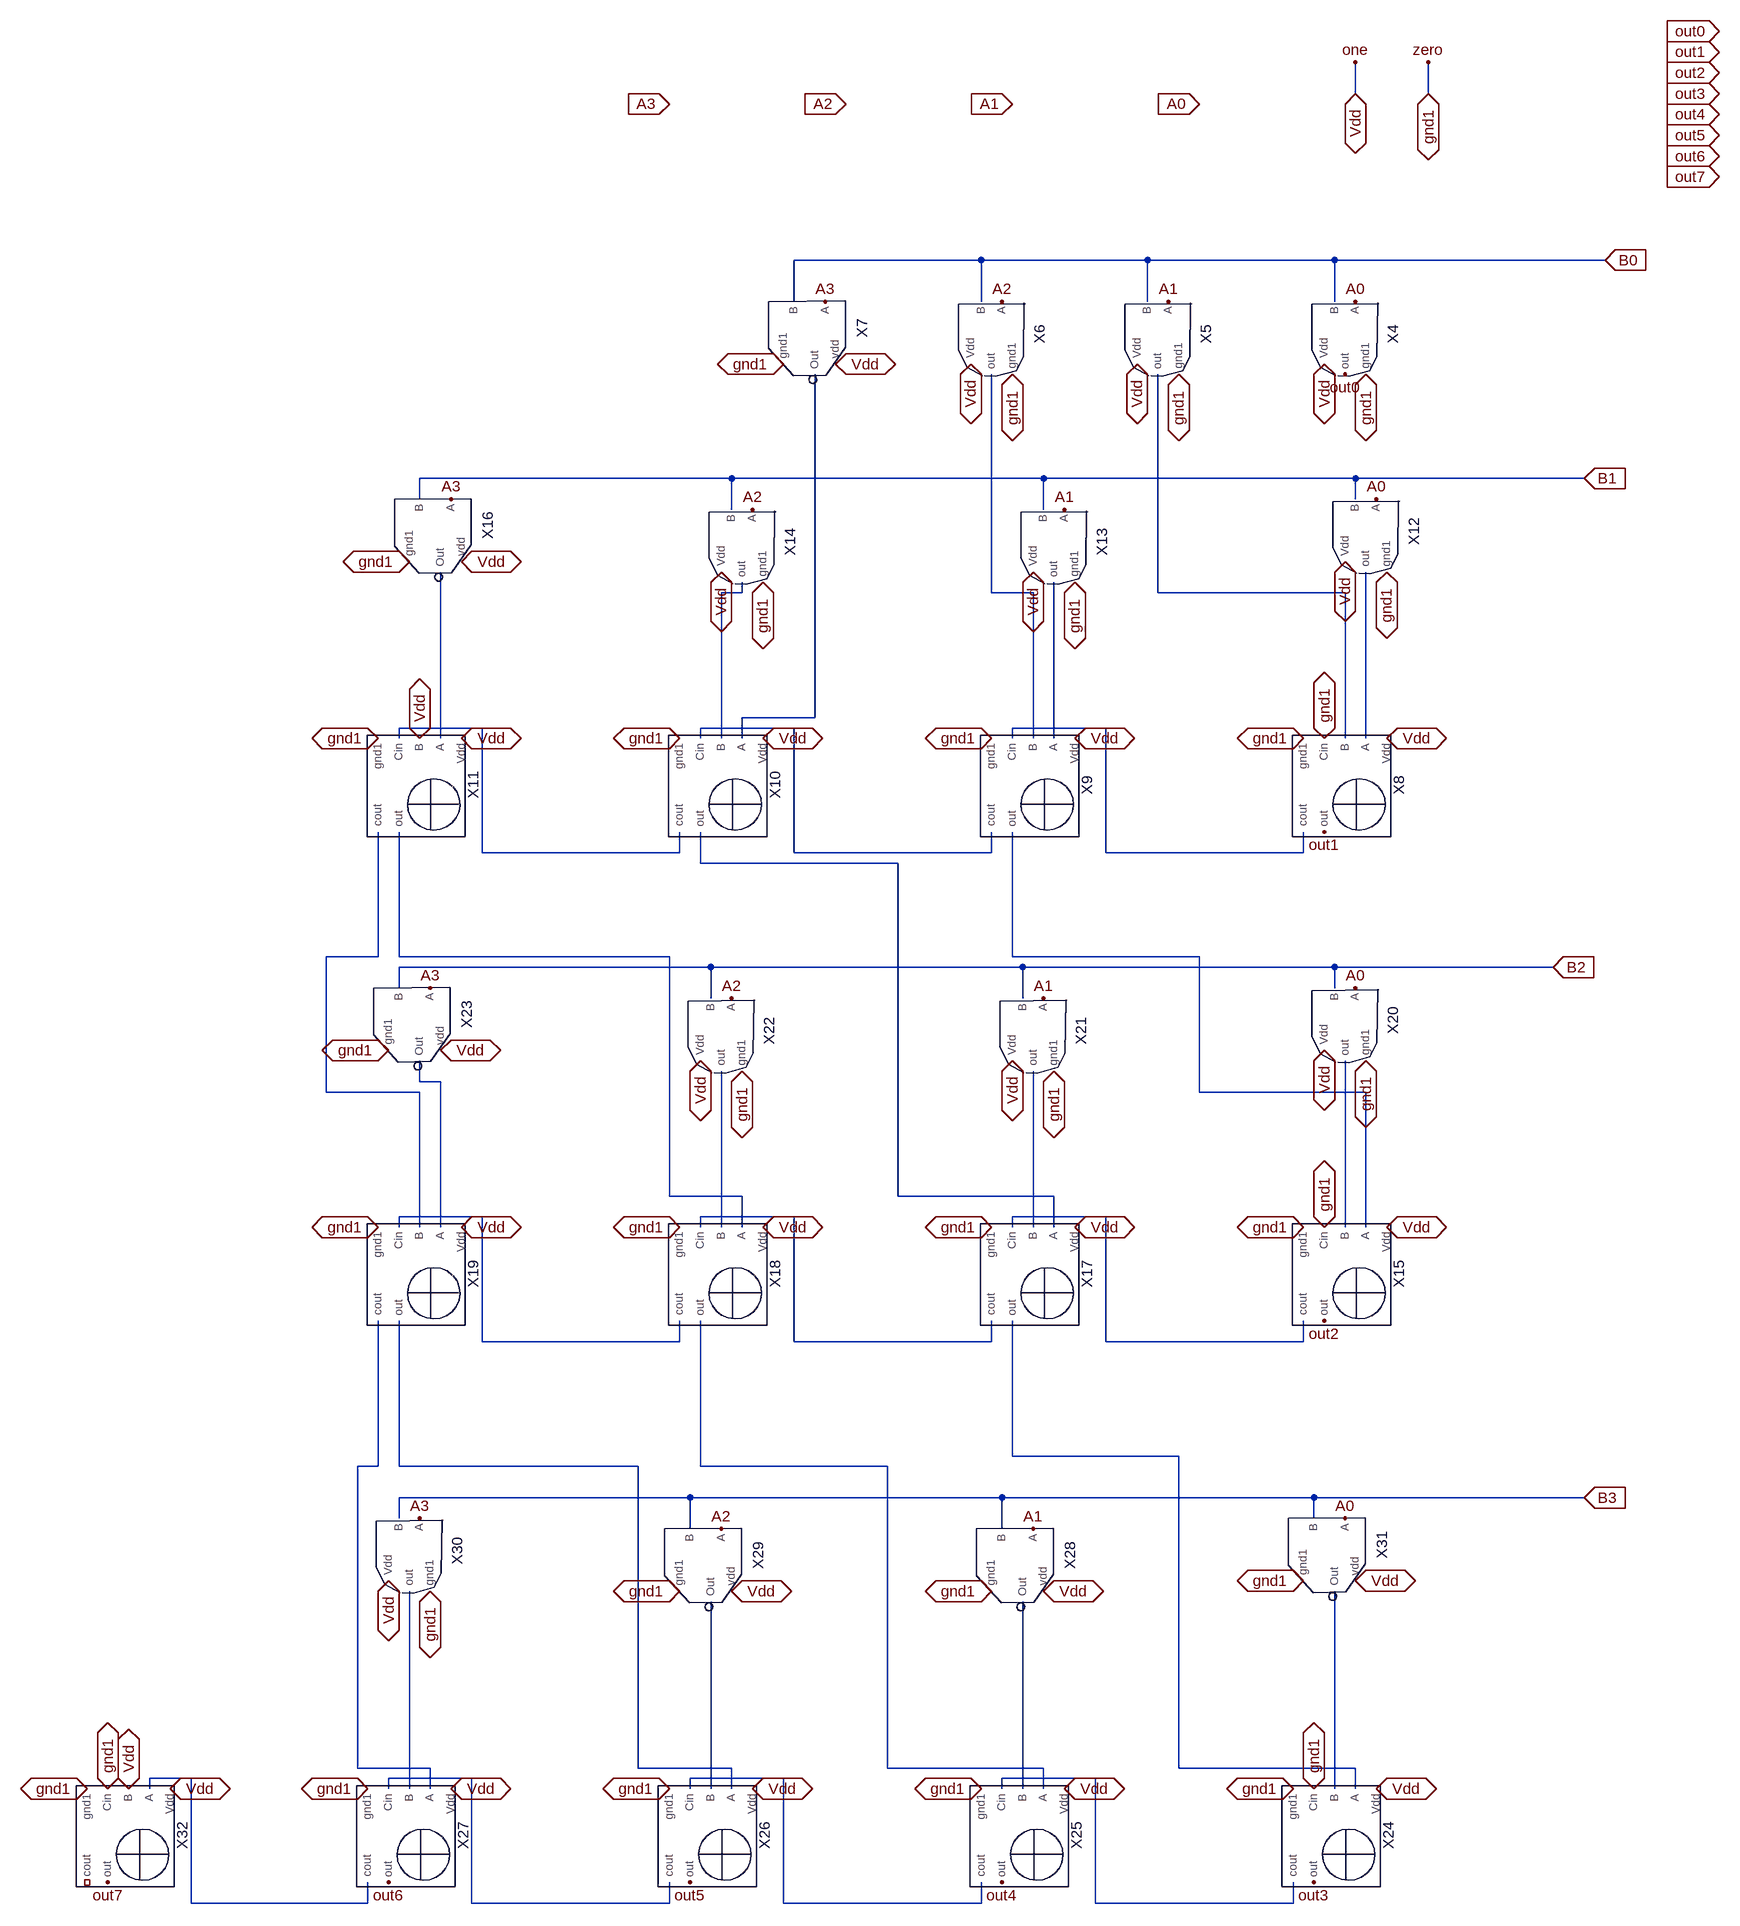
[diagram p0: schematic mult1.asc]
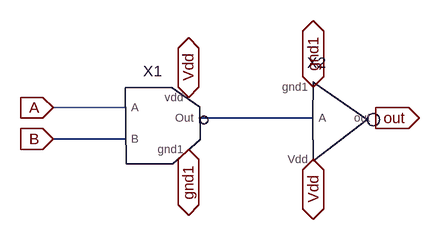
[diagram p1: sub-circuit anddddd.asc]
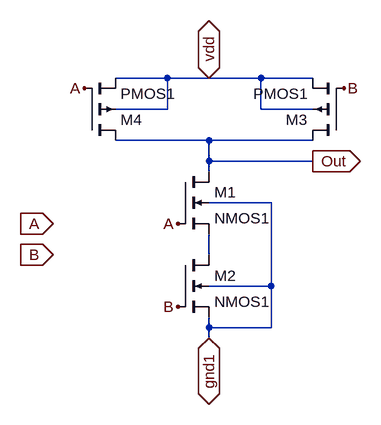
[diagram p2: sub-circuit nand.asc]
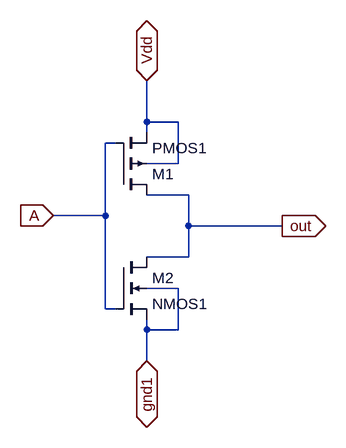
[diagram p3: sub-circuit not.asc]
mult1.asc, the LTspice schematic file:
Version 4.1
SHEET 1 1212 2548
WIRE 224 -304 224 -352
WIRE 336 -304 336 -352
WIRE -352 -48 -640 -48
WIRE -96 -48 -352 -48
WIRE 192 -48 -96 -48
WIRE 608 -48 192 -48
WIRE -640 16 -640 -48
WIRE -352 16 -352 -48
WIRE -96 16 -96 -48
WIRE 192 16 192 -48
WIRE -736 288 -1216 288
WIRE -256 288 -736 288
WIRE 224 288 -256 288
WIRE 576 288 224 288
WIRE -1216 320 -1216 288
WIRE 224 320 224 288
WIRE -736 336 -736 288
WIRE -256 336 -256 288
WIRE -720 464 -720 448
WIRE -720 464 -752 464
WIRE -336 464 -336 128
WIRE -272 464 -336 464
WIRE -80 464 -80 128
WIRE 208 464 -80 464
WIRE -608 656 -608 128
WIRE -608 656 -720 656
WIRE -1120 672 -1248 672
WIRE -640 672 -784 672
WIRE -160 672 -304 672
WIRE -1248 688 -1248 672
WIRE -1184 688 -1184 432
WIRE -784 688 -784 672
WIRE -752 688 -752 464
WIRE -720 688 -720 656
WIRE -304 688 -304 672
WIRE -272 688 -272 464
WIRE -240 688 -240 448
WIRE 208 688 208 464
WIRE 240 688 240 432
WIRE -1120 864 -1120 672
WIRE -816 864 -816 832
WIRE -816 864 -1120 864
WIRE -640 864 -640 672
WIRE -336 864 -336 832
WIRE -336 864 -640 864
WIRE -160 864 -160 672
WIRE 144 864 144 832
WIRE 144 864 -160 864
WIRE -784 880 -784 832
WIRE -480 880 -784 880
WIRE -1280 1024 -1280 832
WIRE -1280 1024 -1360 1024
WIRE -1248 1024 -1248 832
WIRE -832 1024 -1248 1024
WIRE -304 1024 -304 832
WIRE -16 1024 -304 1024
WIRE -768 1040 -1248 1040
WIRE -288 1040 -768 1040
WIRE 192 1040 -288 1040
WIRE 528 1040 192 1040
WIRE -1248 1072 -1248 1040
WIRE 192 1072 192 1040
WIRE -768 1088 -768 1040
WIRE -288 1088 -288 1040
WIRE -1216 1216 -1216 1184
WIRE -1184 1216 -1216 1216
WIRE -1360 1232 -1360 1024
WIRE -1216 1232 -1360 1232
WIRE -16 1232 -16 1024
WIRE 240 1232 -16 1232
WIRE -832 1392 -832 1024
WIRE -720 1392 -832 1392
WIRE -480 1392 -480 880
WIRE -240 1392 -480 1392
WIRE -1120 1424 -1248 1424
WIRE -640 1424 -784 1424
WIRE -160 1424 -304 1424
WIRE -1248 1440 -1248 1424
WIRE -1216 1440 -1216 1232
WIRE -1184 1440 -1184 1216
WIRE -784 1440 -784 1424
WIRE -752 1440 -752 1200
WIRE -720 1440 -720 1392
WIRE -304 1440 -304 1424
WIRE -272 1440 -272 1200
WIRE -240 1440 -240 1392
WIRE 208 1440 208 1184
WIRE 240 1440 240 1232
WIRE -1120 1616 -1120 1424
WIRE -816 1616 -816 1584
WIRE -816 1616 -1120 1616
WIRE -640 1616 -640 1424
WIRE -336 1616 -336 1584
WIRE -336 1616 -640 1616
WIRE -160 1616 -160 1424
WIRE 144 1616 144 1584
WIRE 144 1616 -160 1616
WIRE -304 1792 -304 1584
WIRE -48 1792 -304 1792
WIRE -1280 1808 -1280 1584
WIRE -1280 1808 -1312 1808
WIRE -1248 1808 -1248 1584
WIRE -880 1808 -1248 1808
WIRE -784 1808 -784 1584
WIRE -496 1808 -784 1808
WIRE -800 1856 -1248 1856
WIRE -320 1856 -800 1856
WIRE 160 1856 -320 1856
WIRE 576 1856 160 1856
WIRE -1248 1888 -1248 1856
WIRE 160 1888 160 1856
WIRE -800 1904 -800 1856
WIRE -320 1904 -320 1856
WIRE -1312 2272 -1312 1808
WIRE -1200 2272 -1312 2272
WIRE -880 2272 -880 1808
WIRE -736 2272 -880 2272
WIRE -496 2272 -496 1808
WIRE -256 2272 -496 2272
WIRE -48 2272 -48 1792
WIRE 224 2272 -48 2272
WIRE -1568 2288 -1632 2288
WIRE -1136 2288 -1264 2288
WIRE -656 2288 -800 2288
WIRE -176 2288 -320 2288
WIRE -1632 2304 -1632 2288
WIRE -1264 2304 -1264 2288
WIRE -1232 2304 -1232 2000
WIRE -1200 2304 -1200 2272
WIRE -800 2304 -800 2288
WIRE -768 2304 -768 2016
WIRE -736 2304 -736 2272
WIRE -320 2304 -320 2288
WIRE -288 2304 -288 2016
WIRE -256 2304 -256 2272
WIRE 192 2304 192 2000
WIRE 224 2304 224 2272
WIRE -1568 2480 -1568 2288
WIRE -1296 2480 -1296 2448
WIRE -1296 2480 -1568 2480
WIRE -1136 2480 -1136 2288
WIRE -832 2480 -832 2448
WIRE -832 2480 -1136 2480
WIRE -656 2480 -656 2288
WIRE -352 2480 -352 2448
WIRE -352 2480 -656 2480
WIRE -176 2480 -176 2288
WIRE 128 2480 128 2448
WIRE 128 2480 -176 2480
FLAG -16 -288 A0
IOPIN -16 -288 In
FLAG -304 -288 A1
IOPIN -304 -288 In
FLAG -560 -288 A2
IOPIN -560 -288 In
FLAG -832 -288 A3
IOPIN -832 -288 In
FLAG 608 -48 B0
IOPIN 608 -48 In
FLAG 576 288 B1
IOPIN 576 288 In
FLAG 528 1040 B2
IOPIN 528 1040 In
FLAG 576 1856 B3
IOPIN 576 1856 In
FLAG 704 -400 out0
IOPIN 704 -400 Out
FLAG 704 -368 out1
IOPIN 704 -368 Out
FLAG 704 -336 out2
IOPIN 704 -336 Out
FLAG 704 -304 out3
IOPIN 704 -304 Out
FLAG 704 -272 out4
IOPIN 704 -272 Out
FLAG 704 -240 out5
IOPIN 704 -240 Out
FLAG 704 -208 out6
IOPIN 704 -208 Out
FLAG 704 -176 out7
IOPIN 704 -176 Out
FLAG 208 128 out0
FLAG -224 336 A1
FLAG -704 336 A2
FLAG -1168 320 A3
FLAG 336 -352 zero
FLAG 224 -352 one
FLAG 256 320 A0
FLAG 176 832 out1
FLAG 176 1584 out2
FLAG -256 1088 A1
FLAG -736 1088 A2
FLAG -1200 1072 A3
FLAG 224 1072 A0
FLAG 160 2448 out3
FLAG -272 1904 A1
FLAG -752 1904 A2
FLAG -1216 1888 A3
FLAG 208 1888 A0
FLAG -320 2448 out4
FLAG -800 2448 out5
FLAG -1264 2448 out6
FLAG -1696 2448 out7
FLAG 336 -304 gnd1
IOPIN 336 -304 BiDir
FLAG 224 -304 Vdd
IOPIN 224 -304 BiDir
FLAG -688 448 gnd1
IOPIN -688 448 BiDir
FLAG 240 128 gnd1
IOPIN 240 128 BiDir
FLAG -48 128 gnd1
IOPIN -48 128 BiDir
FLAG -304 128 gnd1
IOPIN -304 128 BiDir
FLAG -656 112 gnd1
IOPIN -656 112 BiDir
FLAG -208 448 gnd1
IOPIN -208 448 BiDir
FLAG 272 432 gnd1
IOPIN 272 432 BiDir
FLAG -1280 688 gnd1
IOPIN -1280 688 BiDir
FLAG 240 1184 gnd1
IOPIN 240 1184 BiDir
FLAG -240 1200 gnd1
IOPIN -240 1200 BiDir
FLAG -720 1200 gnd1
IOPIN -720 1200 BiDir
FLAG -1264 1168 gnd1
IOPIN -1264 1168 BiDir
FLAG -816 688 gnd1
IOPIN -816 688 BiDir
FLAG -336 688 gnd1
IOPIN -336 688 BiDir
FLAG 144 688 gnd1
IOPIN 144 688 BiDir
FLAG 144 1440 gnd1
IOPIN 144 1440 BiDir
FLAG -336 1440 gnd1
IOPIN -336 1440 BiDir
FLAG -816 1440 gnd1
IOPIN -816 1440 BiDir
FLAG -1280 1440 gnd1
IOPIN -1280 1440 BiDir
FLAG 144 1984 gnd1
IOPIN 144 1984 BiDir
FLAG 128 2304 gnd1
IOPIN 128 2304 BiDir
FLAG -352 2304 gnd1
IOPIN -352 2304 BiDir
FLAG -336 2000 gnd1
IOPIN -336 2000 BiDir
FLAG -816 2000 gnd1
IOPIN -816 2000 BiDir
FLAG -832 2304 gnd1
IOPIN -832 2304 BiDir
FLAG -1200 2000 gnd1
IOPIN -1200 2000 BiDir
FLAG -1296 2304 gnd1
IOPIN -1296 2304 BiDir
FLAG -1728 2304 gnd1
IOPIN -1728 2304 BiDir
FLAG 176 112 Vdd
IOPIN 176 112 BiDir
FLAG -112 112 Vdd
IOPIN -112 112 BiDir
FLAG -368 112 Vdd
IOPIN -368 112 BiDir
FLAG -576 112 Vdd
IOPIN -576 112 BiDir
FLAG -752 432 Vdd
IOPIN -752 432 BiDir
FLAG -272 432 Vdd
IOPIN -272 432 BiDir
FLAG 208 416 Vdd
IOPIN 208 416 BiDir
FLAG 272 688 Vdd
IOPIN 272 688 BiDir
FLAG -208 688 Vdd
IOPIN -208 688 BiDir
FLAG -688 688 Vdd
IOPIN -688 688 BiDir
FLAG -1152 688 Vdd
IOPIN -1152 688 BiDir
FLAG -1184 1168 Vdd
IOPIN -1184 1168 BiDir
FLAG -784 1184 Vdd
IOPIN -784 1184 BiDir
FLAG -304 1184 Vdd
IOPIN -304 1184 BiDir
FLAG 176 1168 Vdd
IOPIN 176 1168 BiDir
FLAG 272 1440 Vdd
IOPIN 272 1440 BiDir
FLAG -208 1440 Vdd
IOPIN -208 1440 BiDir
FLAG -688 1440 Vdd
IOPIN -688 1440 BiDir
FLAG -1152 1440 Vdd
IOPIN -1152 1440 BiDir
FLAG -1264 1984 Vdd
IOPIN -1264 1984 BiDir
FLAG -736 2000 Vdd
IOPIN -736 2000 BiDir
FLAG -256 2000 Vdd
IOPIN -256 2000 BiDir
FLAG 224 1984 Vdd
IOPIN 224 1984 BiDir
FLAG 256 2304 Vdd
IOPIN 256 2304 BiDir
FLAG -224 2304 Vdd
IOPIN -224 2304 BiDir
FLAG -704 2304 Vdd
IOPIN -704 2304 BiDir
FLAG -1168 2304 Vdd
IOPIN -1168 2304 BiDir
FLAG -1600 2304 Vdd
IOPIN -1600 2304 BiDir
FLAG 224 16 A0
FLAG -64 16 A1
FLAG -320 16 A2
FLAG -592 16 A3
FLAG 176 688 gnd1
IOPIN 176 688 BiDir
FLAG 176 1440 gnd1
IOPIN 176 1440 BiDir
FLAG 160 2304 gnd1
IOPIN 160 2304 BiDir
FLAG -1696 2304 gnd1
IOPIN -1696 2304 BiDir
FLAG -1664 2304 Vdd
IOPIN -1664 2304 BiDir
FLAG -1216 688 Vdd
IOPIN -1216 688 BiDir
FLAG -1152 416 Vdd
IOPIN -1152 416 BiDir
FLAG -1232 416 gnd1
IOPIN -1232 416 BiDir
SYMBOL ANDDDDD 208 64 R90
SYMATTR InstName X4
SYMBOL ANDDDDD -80 64 R90
SYMATTR InstName X5
SYMBOL ANDDDDD -336 64 R90
SYMATTR InstName X6
SYMBOL NAND -624 64 R90
SYMATTR InstName X7
SYMBOL full_adder 208 752 R90
SYMATTR InstName X8
SYMBOL full_adder -272 752 R90
SYMATTR InstName X9
SYMBOL full_adder -752 752 R90
SYMATTR InstName X10
SYMBOL full_adder -1216 752 R90
SYMATTR InstName X11
SYMBOL ANDDDDD 240 368 R90
SYMATTR InstName X12
SYMBOL ANDDDDD -240 384 R90
SYMATTR InstName X13
SYMBOL ANDDDDD -720 384 R90
SYMATTR InstName X14
SYMBOL NAND -1200 368 R90
SYMATTR InstName X16
SYMBOL full_adder 208 1504 R90
SYMATTR InstName X15
SYMBOL full_adder -272 1504 R90
SYMATTR InstName X17
SYMBOL full_adder -752 1504 R90
SYMATTR InstName X18
SYMBOL full_adder -1216 1504 R90
SYMATTR InstName X19
SYMBOL ANDDDDD 208 1120 R90
SYMATTR InstName X20
SYMBOL ANDDDDD -272 1136 R90
SYMATTR InstName X21
SYMBOL ANDDDDD -752 1136 R90
SYMATTR InstName X22
SYMBOL NAND -1232 1120 R90
SYMATTR InstName X23
SYMBOL full_adder 192 2368 R90
SYMATTR InstName X24
SYMBOL full_adder -288 2368 R90
SYMATTR InstName X25
SYMBOL full_adder -768 2368 R90
SYMATTR InstName X26
SYMBOL full_adder -1232 2368 R90
SYMATTR InstName X27
SYMBOL ANDDDDD -1232 1936 R90
SYMATTR InstName X30
SYMBOL NAND 176 1936 R90
SYMATTR InstName X31
SYMBOL NAND -304 1952 R90
SYMATTR InstName X28
SYMBOL NAND -784 1952 R90
SYMATTR InstName X29
SYMBOL full_adder -1664 2368 R90
SYMATTR InstName X32

anddddd.asc, the sub-circuit schematic file:
Version 4.1
SHEET 1 880 680
WIRE 64 160 -48 160
WIRE 352 176 176 176
WIRE 64 208 -48 208
FLAG -48 160 A
IOPIN -48 160 In
FLAG -48 208 B
IOPIN -48 208 In
FLAG 160 224 gnd1
IOPIN 160 224 BiDir
FLAG 160 144 Vdd
IOPIN 160 144 BiDir
FLAG 352 128 gnd1
IOPIN 352 128 BiDir
FLAG 352 240 Vdd
IOPIN 352 240 BiDir
FLAG 448 176 out
IOPIN 448 176 Out
SYMBOL NAND 112 192 R0
SYMATTR InstName X1
SYMBOL NOT 384 176 R0
SYMATTR InstName X2

nand.asc, the sub-circuit schematic file:
Version 4.1
SHEET 1 880 680
WIRE 176 0 96 0
WIRE 240 0 176 0
WIRE 320 0 240 0
WIRE 400 0 320 0
WIRE 176 48 176 0
WIRE 176 48 96 48
WIRE 320 48 320 0
WIRE 400 48 320 48
WIRE 240 96 96 96
WIRE 400 96 240 96
WIRE 240 128 240 96
WIRE 400 128 240 128
WIRE 240 144 240 128
WIRE 336 192 240 192
WIRE 240 272 240 240
WIRE 336 320 336 192
WIRE 336 320 240 320
WIRE 240 384 240 368
WIRE 336 384 336 320
WIRE 336 384 240 384
WIRE 240 400 240 384
FLAG 0 224 A
IOPIN 0 224 In
FLAG 0 272 B
IOPIN 0 272 In
FLAG 400 128 Out
IOPIN 400 128 Out
FLAG 240 400 gnd1
IOPIN 240 400 BiDir
FLAG 240 0 vdd
IOPIN 240 0 BiDir
FLAG 48 16 A
FLAG 192 224 A
FLAG 192 352 B
FLAG 448 16 B
SYMBOL nmos4 192 144 R0
SYMATTR InstName M1
SYMATTR Value2 l=1u w=2u
SYMATTR Value NMOS1
SYMBOL nmos4 192 272 R0
SYMATTR InstName M2
SYMATTR Value2 l=1u w=2u
SYMATTR Value NMOS1
SYMBOL pmos4 448 96 R180
SYMATTR InstName M3
SYMATTR Value2 l=1u w=2u
SYMATTR Value PMOS1
SYMBOL pmos4 48 96 M180
SYMATTR InstName M4
SYMATTR Value2 l=1u w=2u
SYMATTR Value PMOS1

not.asc, the sub-circuit schematic file:
Version 4.1
SHEET 1 880 680
WIRE 256 64 256 0
WIRE 304 64 256 64
WIRE 256 80 256 64
WIRE 208 96 192 96
WIRE 304 128 304 64
WIRE 304 128 256 128
WIRE 320 176 256 176
WIRE 192 208 192 96
WIRE 192 208 112 208
WIRE 320 224 320 176
WIRE 464 224 320 224
WIRE 320 272 320 224
WIRE 320 272 256 272
WIRE 304 320 256 320
WIRE 192 352 192 208
WIRE 208 352 192 352
WIRE 256 384 256 368
WIRE 304 384 304 320
WIRE 304 384 256 384
WIRE 256 432 256 384
FLAG 256 432 gnd1
IOPIN 256 432 BiDir
FLAG 256 0 Vdd
IOPIN 256 0 BiDir
FLAG 464 224 out
IOPIN 464 224 Out
FLAG 112 208 A
IOPIN 112 208 In
SYMBOL pmos4 208 176 M180
SYMATTR InstName M1
SYMATTR Value2 l=1u w=2u
SYMATTR Value PMOS1
SYMBOL nmos4 208 272 R0
SYMATTR InstName M2
SYMATTR Value2 l=1u w=2u
SYMATTR Value NMOS1

The netlist it stands for:
* mult1.asc
X§X4 A0 B0 gnd1 out0 Vdd anddddd
X§X5 A1 B0 gnd1 N003 Vdd anddddd
X§X6 A2 B0 gnd1 N002 Vdd anddddd
X§X7 A3 B0 gnd1 N004 Vdd nand
X§X8 N010 N003 gnd1 N007 gnd1 out1 Vdd full_adder  ; pins A B Cin cout gnd1 out Vdd
X§X9 N009 N002 N007 N006 gnd1 N014 Vdd full_adder  ; pins A B Cin cout gnd1 out Vdd
X§X10 N004 N001 N006 N005 gnd1 N011 Vdd full_adder  ; pins A B Cin cout gnd1 out Vdd
X§X11 N008 Vdd N005 N012 gnd1 N013 Vdd full_adder  ; pins A B Cin cout gnd1 out Vdd
X§X12 A0 B1 gnd1 N010 Vdd anddddd
X§X13 A1 B1 gnd1 N009 Vdd anddddd
X§X14 A2 B1 gnd1 N001 Vdd anddddd
X§X16 A3 B1 gnd1 N008 Vdd nand
X§X15 N014 N021 gnd1 N018 gnd1 out2 Vdd full_adder  ; pins A B Cin cout gnd1 out Vdd
X§X17 N011 N020 N018 N017 gnd1 N022 Vdd full_adder  ; pins A B Cin cout gnd1 out Vdd
X§X18 N013 N019 N017 N016 gnd1 N025 Vdd full_adder  ; pins A B Cin cout gnd1 out Vdd
X§X19 N015 N012 N016 N023 gnd1 N024 Vdd full_adder  ; pins A B Cin cout gnd1 out Vdd
X§X20 A0 B2 gnd1 N021 Vdd anddddd
X§X21 A1 B2 gnd1 N020 Vdd anddddd
X§X22 A2 B2 gnd1 N019 Vdd anddddd
X§X23 A3 B2 gnd1 N015 Vdd nand
X§X24 N022 N033 gnd1 N029 gnd1 out3 Vdd full_adder  ; pins A B Cin cout gnd1 out Vdd
X§X25 N025 N032 N029 N028 gnd1 out4 Vdd full_adder  ; pins A B Cin cout gnd1 out Vdd
X§X26 N024 N031 N028 N027 gnd1 out5 Vdd full_adder  ; pins A B Cin cout gnd1 out Vdd
X§X27 N023 N030 N027 N026 gnd1 out6 Vdd full_adder  ; pins A B Cin cout gnd1 out Vdd
X§X30 A3 B3 gnd1 N030 Vdd anddddd
X§X31 A0 B3 gnd1 N033 Vdd nand
X§X28 A1 B3 gnd1 N032 Vdd nand
X§X29 A2 B3 gnd1 N031 Vdd nand
X§X32 N026 Vdd gnd1 NC_01 gnd1 out7 Vdd full_adder  ; pins A B Cin cout gnd1 out Vdd

* block symbol definitions
.subckt anddddd A B gnd1 out Vdd
X§X1 A B gnd1 N001 Vdd nand
X§X2 N001 gnd1 out Vdd not
.ends anddddd

.subckt nand A B gnd1 Out vdd
M1 Out A N001 gnd1 NMOS1 l=1u w=2u
M2 N001 B gnd1 gnd1 NMOS1 l=1u w=2u
M3 Out B vdd vdd PMOS1 l=1u w=2u
M4 Out A vdd vdd PMOS1 l=1u w=2u
.ends nand

.subckt not A gnd1 out Vdd
M1 out A Vdd Vdd PMOS1 l=1u w=2u
M2 out A gnd1 gnd1 NMOS1 l=1u w=2u
.ends not

.model NMOS NMOS
.model PMOS PMOS
.lib standard.mos
.backanno
.end